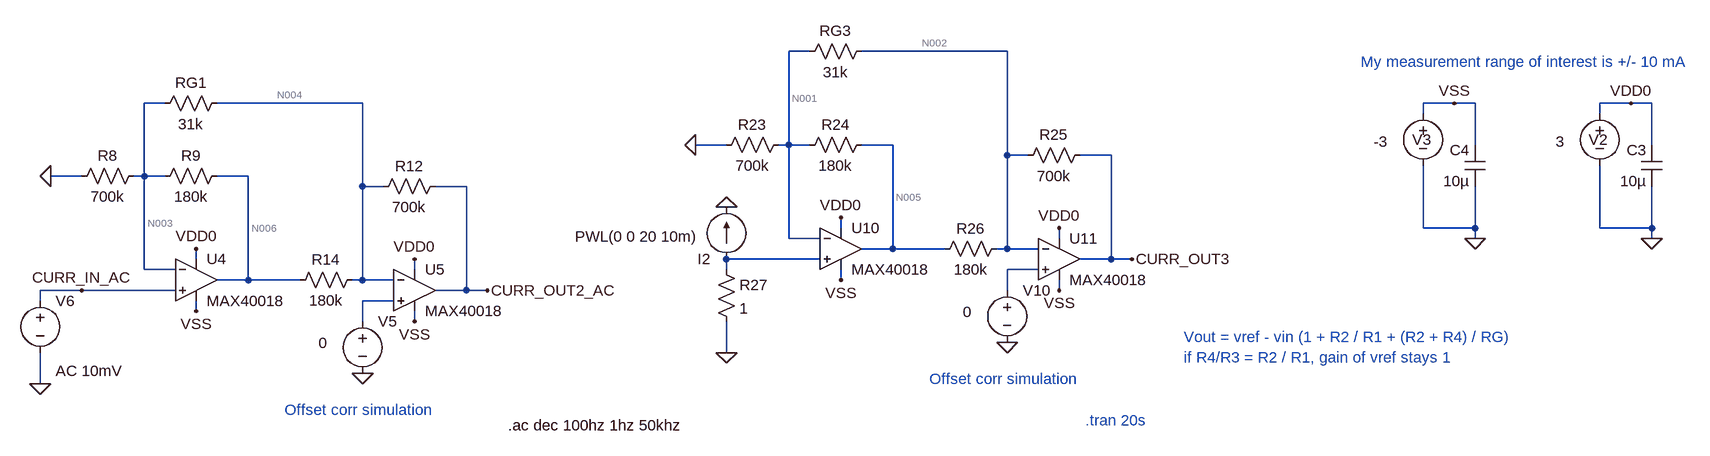
[diagram p0: schematic curr_meas_dc_v2(gain-50).asc]
curr_meas_dc_v2(gain-50).asc, the LTspice schematic file:
Version 4.1
SHEET 1 1464 1192
WIRE -400 -96 -432 -96
WIRE -96 -96 -320 -96
WIRE -1392 -16 -1424 -16
WIRE -1088 -16 -1312 -16
WIRE 592 -16 544 -16
WIRE 624 -16 592 -16
WIRE 864 -16 816 -16
WIRE 896 -16 864 -16
WIRE 544 0 544 -16
WIRE 816 0 816 -16
WIRE -528 48 -576 48
WIRE -432 48 -432 -96
WIRE -432 48 -448 48
WIRE -400 48 -432 48
WIRE -272 48 -320 48
WIRE 624 48 624 -16
WIRE 896 48 896 -16
WIRE -96 64 -96 -96
WIRE -64 64 -96 64
WIRE 64 64 16 64
WIRE -1520 96 -1568 96
WIRE -1424 96 -1424 -16
WIRE -1424 96 -1440 96
WIRE -1392 96 -1424 96
WIRE -1264 96 -1312 96
WIRE -1088 112 -1088 -16
WIRE -1056 112 -1088 112
WIRE -928 112 -976 112
WIRE -352 176 -352 160
WIRE 544 176 544 80
WIRE 624 176 624 112
WIRE 624 176 544 176
WIRE 816 176 816 80
WIRE 896 176 896 112
WIRE 896 176 816 176
WIRE -432 192 -432 48
WIRE -384 192 -432 192
WIRE -16 192 -16 176
WIRE 624 192 624 176
WIRE 896 192 896 176
WIRE -272 208 -272 48
WIRE -272 208 -320 208
WIRE -192 208 -272 208
WIRE -96 208 -96 64
WIRE -96 208 -112 208
WIRE -48 208 -96 208
WIRE -1344 224 -1344 208
WIRE -384 224 -528 224
WIRE 64 224 64 64
WIRE 64 224 16 224
WIRE 96 224 64 224
WIRE -1424 240 -1424 96
WIRE -1376 240 -1424 240
WIRE -1008 240 -1008 224
WIRE -528 240 -528 224
WIRE -48 240 -96 240
WIRE -1264 256 -1264 96
WIRE -1264 256 -1312 256
WIRE -1184 256 -1264 256
WIRE -1088 256 -1088 112
WIRE -1088 256 -1104 256
WIRE -1040 256 -1088 256
WIRE -352 256 -352 240
WIRE -1520 272 -1584 272
WIRE -1376 272 -1520 272
WIRE -928 272 -928 112
WIRE -928 272 -976 272
WIRE -896 272 -928 272
WIRE -96 272 -96 240
WIRE -16 272 -16 256
WIRE -1584 288 -1584 272
WIRE -1040 288 -1088 288
WIRE -1344 304 -1344 288
WIRE -1088 320 -1088 288
WIRE -1008 320 -1008 304
WIRE -528 368 -528 320
WIRE -1584 416 -1584 368
FLAG 864 -16 VDD0
FLAG 592 -16 VSS
FLAG 896 192 0
FLAG 624 192 0
FLAG -1344 304 VSS
FLAG -1344 208 VDD0
FLAG -1008 320 VSS
FLAG -1008 224 VDD0
FLAG -1088 400 0
FLAG -1568 96 0
FLAG -896 272 CURR_OUT2_AC
FLAG -1520 272 CURR_IN_AC
FLAG -1584 416 0
FLAG -352 256 VSS
FLAG -352 160 VDD0
FLAG -16 272 VSS
FLAG -16 176 VDD0
FLAG -96 352 0
FLAG -576 48 0
FLAG 96 224 CURR_OUT3
FLAG -528 144 0
FLAG -528 368 0
SYMBOL voltage 816 -16 M0
WINDOW 123 0 0 Left 2
WINDOW 39 0 0 Left 2
WINDOW 0 2 56 Center 2
WINDOW 3 54 59 Left 2
SYMATTR InstName V2
SYMATTR Value 3
SYMBOL cap 912 112 R180
WINDOW 0 24 56 Left 2
WINDOW 3 24 8 Left 2
SYMATTR InstName C3
SYMATTR Value 10µ
SYMATTR SpiceLine V=6.3 Irms=5.2 Rser=0.0063 Lser=4.18n
SYMBOL voltage 544 -16 M0
WINDOW 123 0 0 Left 2
WINDOW 39 0 0 Left 2
WINDOW 0 2 56 Center 2
WINDOW 3 54 59 Left 2
SYMATTR InstName V3
SYMATTR Value -3
SYMBOL cap 640 112 R180
WINDOW 0 24 56 Left 2
WINDOW 3 24 8 Left 2
SYMATTR InstName C4
SYMATTR Value 10µ
SYMATTR SpiceLine V=6.3 Irms=5.2 Rser=0.0063 Lser=4.18n
SYMBOL OpAmps\\MAX40018 -1344 192 R0
SYMATTR InstName U4
SYMBOL res -1536 112 R270
WINDOW 0 32 56 VTop 2
WINDOW 3 0 56 VBottom 2
SYMATTR InstName R8
SYMATTR Value 700k
SYMBOL res -1408 112 R270
WINDOW 0 32 56 VTop 2
WINDOW 3 0 56 VBottom 2
SYMATTR InstName R9
SYMATTR Value 180k
SYMBOL OpAmps\\MAX40018 -1008 208 R0
SYMATTR InstName U5
SYMBOL res -1072 128 R270
WINDOW 0 32 56 VTop 2
WINDOW 3 0 56 VBottom 2
SYMATTR InstName R12
SYMATTR Value 700k
SYMBOL res -1200 272 R270
WINDOW 0 32 56 VTop 2
WINDOW 3 0 56 VBottom 2
SYMATTR InstName R14
SYMATTR Value 180k
SYMBOL res -1408 0 R270
WINDOW 0 32 56 VTop 2
WINDOW 3 0 56 VBottom 2
SYMATTR InstName RG1
SYMATTR Value 31k
SYMBOL voltage -1088 304 R0
WINDOW 3 -68 49 Left 2
WINDOW 123 24 124 Left 2
WINDOW 39 0 0 Left 0
SYMATTR Value 0
SYMATTR InstName V5
SYMBOL voltage -1584 272 R0
WINDOW 123 24 124 Left 2
WINDOW 39 0 0 Left 0
SYMATTR Value2 AC 10mV
SYMATTR InstName V6
SYMATTR Value ""
SYMBOL OpAmps\\MAX40018 -352 144 R0
SYMATTR InstName U10
SYMBOL res -544 64 R270
WINDOW 0 32 56 VTop 2
WINDOW 3 0 56 VBottom 2
SYMATTR InstName R23
SYMATTR Value 700k
SYMBOL res -416 64 R270
WINDOW 0 32 56 VTop 2
WINDOW 3 0 56 VBottom 2
SYMATTR InstName R24
SYMATTR Value 180k
SYMBOL OpAmps\\MAX40018 -16 160 R0
SYMATTR InstName U11
SYMBOL res -80 80 R270
WINDOW 0 32 56 VTop 2
WINDOW 3 0 56 VBottom 2
SYMATTR InstName R25
SYMATTR Value 700k
SYMBOL res -208 224 R270
WINDOW 0 32 56 VTop 2
WINDOW 3 0 56 VBottom 2
SYMATTR InstName R26
SYMATTR Value 180k
SYMBOL res -416 -80 R270
WINDOW 0 32 56 VTop 2
WINDOW 3 0 56 VBottom 2
SYMATTR InstName RG3
SYMATTR Value 31k
SYMBOL voltage -96 256 R0
WINDOW 3 -68 49 Left 2
WINDOW 123 24 124 Left 2
WINDOW 39 0 0 Left 0
SYMATTR Value 0
SYMATTR InstName V10
SYMBOL res -544 224 R0
SYMATTR InstName R27
SYMATTR Value 1
SYMBOL current -528 224 R180
WINDOW 3 43 35 Left 2
WINDOW 123 0 0 Left 0
WINDOW 39 0 0 Left 0
SYMATTR Value PWL(0 0 20 10m)
SYMATTR InstName I2
TEXT 24 472 Left 2 ;.tran 20s
TEXT 176 344 Left 2 ;Vout = vref - vin (1 + R2 / R1 + (R2 + R4) / RG)\nif R4/R3 = R2 / R1, gain of vref stays 1
TEXT 448 -80 Left 2 ;My measurement range of interest is +/- 10 mA
TEXT -1208 456 Left 2 ;Offset corr simulation
TEXT -864 480 Left 2 !.ac dec 100hz 1hz 50khz
TEXT -216 408 Left 2 ;Offset corr simulation

The netlist it stands for:
* curr_meas_dc_v2(gain-50).asc
V2 VDD0 0 3
C3 0 VDD0 10µ V=6.3 Irms=5.2 Rser=0.0063 Lser=4.18n
V3 VSS 0 -3
C4 0 VSS 10µ V=6.3 Irms=5.2 Rser=0.0063 Lser=4.18n
X§U4 CURR_IN_AC N003 VDD0 VSS N006 MAX40018  ; pins In+ In- V+ V- OUT
R8 0 N003 700k
R9 N003 N006 180k
X§U5 N009 N004 VDD0 VSS CURR_OUT2_AC MAX40018  ; pins In+ In- V+ V- OUT
R12 N004 CURR_OUT2_AC 700k
R14 N006 N004 180k
RG1 N003 N004 31k
V5 N009 0 0
V6 CURR_IN_AC 0 AC 10mV
X§U10 N007 N001 VDD0 VSS N005 MAX40018  ; pins In+ In- V+ V- OUT
R23 0 N001 700k
R24 N001 N005 180k
X§U11 N008 N002 VDD0 VSS CURR_OUT3 MAX40018  ; pins In+ In- V+ V- OUT
R25 N002 CURR_OUT3 700k
R26 N005 N002 180k
RG3 N001 N002 31k
V10 N008 0 0
R27 N007 0 1
I2 N007 0 PWL(0 0 20 10m)
* .tran 20s
* Vout = vref - vin (1 + R2 / R1 + (R2 + R4) / RG)
* if R4/R3 = R2 / R1, gain of vref stays 1
* My measurement range of interest is +/- 10 mA
* Offset corr simulation
.ac dec 100hz 1hz 50khz
* Offset corr simulation
.backanno
.end

* Results of the author's LTspice run, read from the files saved beside the schematic
* Operating Point, zero values left out:
*   V(curr_out2_ac) = 61.89 nV
*   V(curr_out3) = 61.9 nV
*   V(n001) = 310.1 µV
*   V(n002) = 310.1 µV
*   V(n003) = 310.1 µV
*   V(n004) = 310.1 µV
*   V(n005) = 389.8 µV
*   V(n006) = 389.8 µV
*   V(vdd0) = 3 V
*   V(vss) = -3 V
*   I(R12) = 442.9 pA
*   I(R14) = 442.9 pA
*   I(R23) = -443 pA
*   I(R24) = -442.9 pA
*   I(R25) = 442.9 pA
*   I(R26) = 442.9 pA
*   I(R8) = -443 pA
*   I(R9) = -442.9 pA
*   I(V2) = -3.163 µA
*   I(V3) = 3.163 µA